# EAGLE schematic et312 (EAGLE 7.3.0)

## Sheet 1 of 6: Description Page
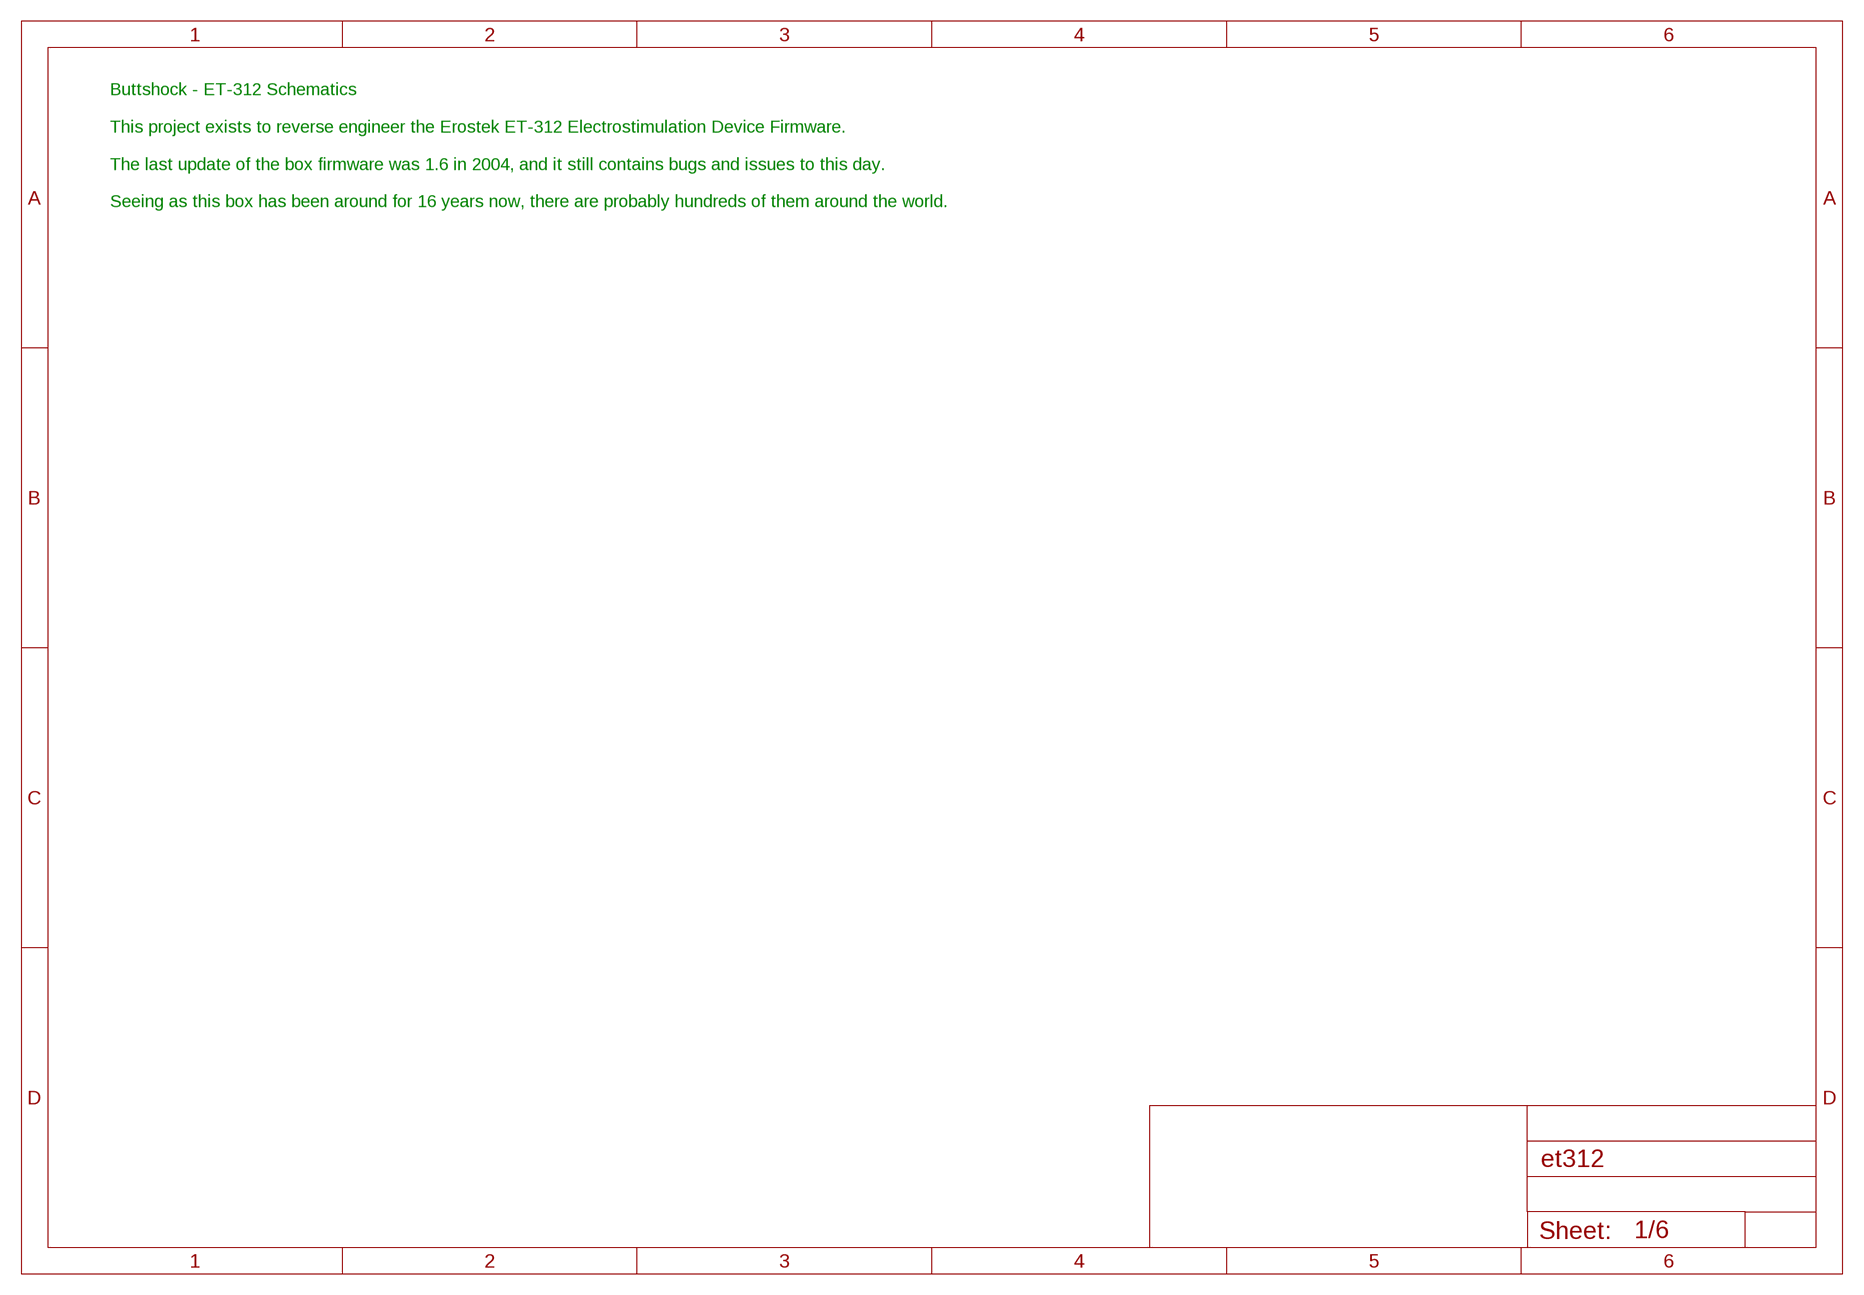
[diagram p0: schematic, sheet 1]

### Notes on the sheet
- Buttshock - ET-312 Schematics
  
  This project exists to reverse engineer the Erostek ET-312 Electrostimulation Device Firmware.
  
  The last update of the box firmware was 1.6 in 2004, and it still contains bugs and issues to this day.
  
  Seeing as this box has been around for 16 years now, there are probably hundreds of them around the world.

## Sheet 2 of 6: PSU
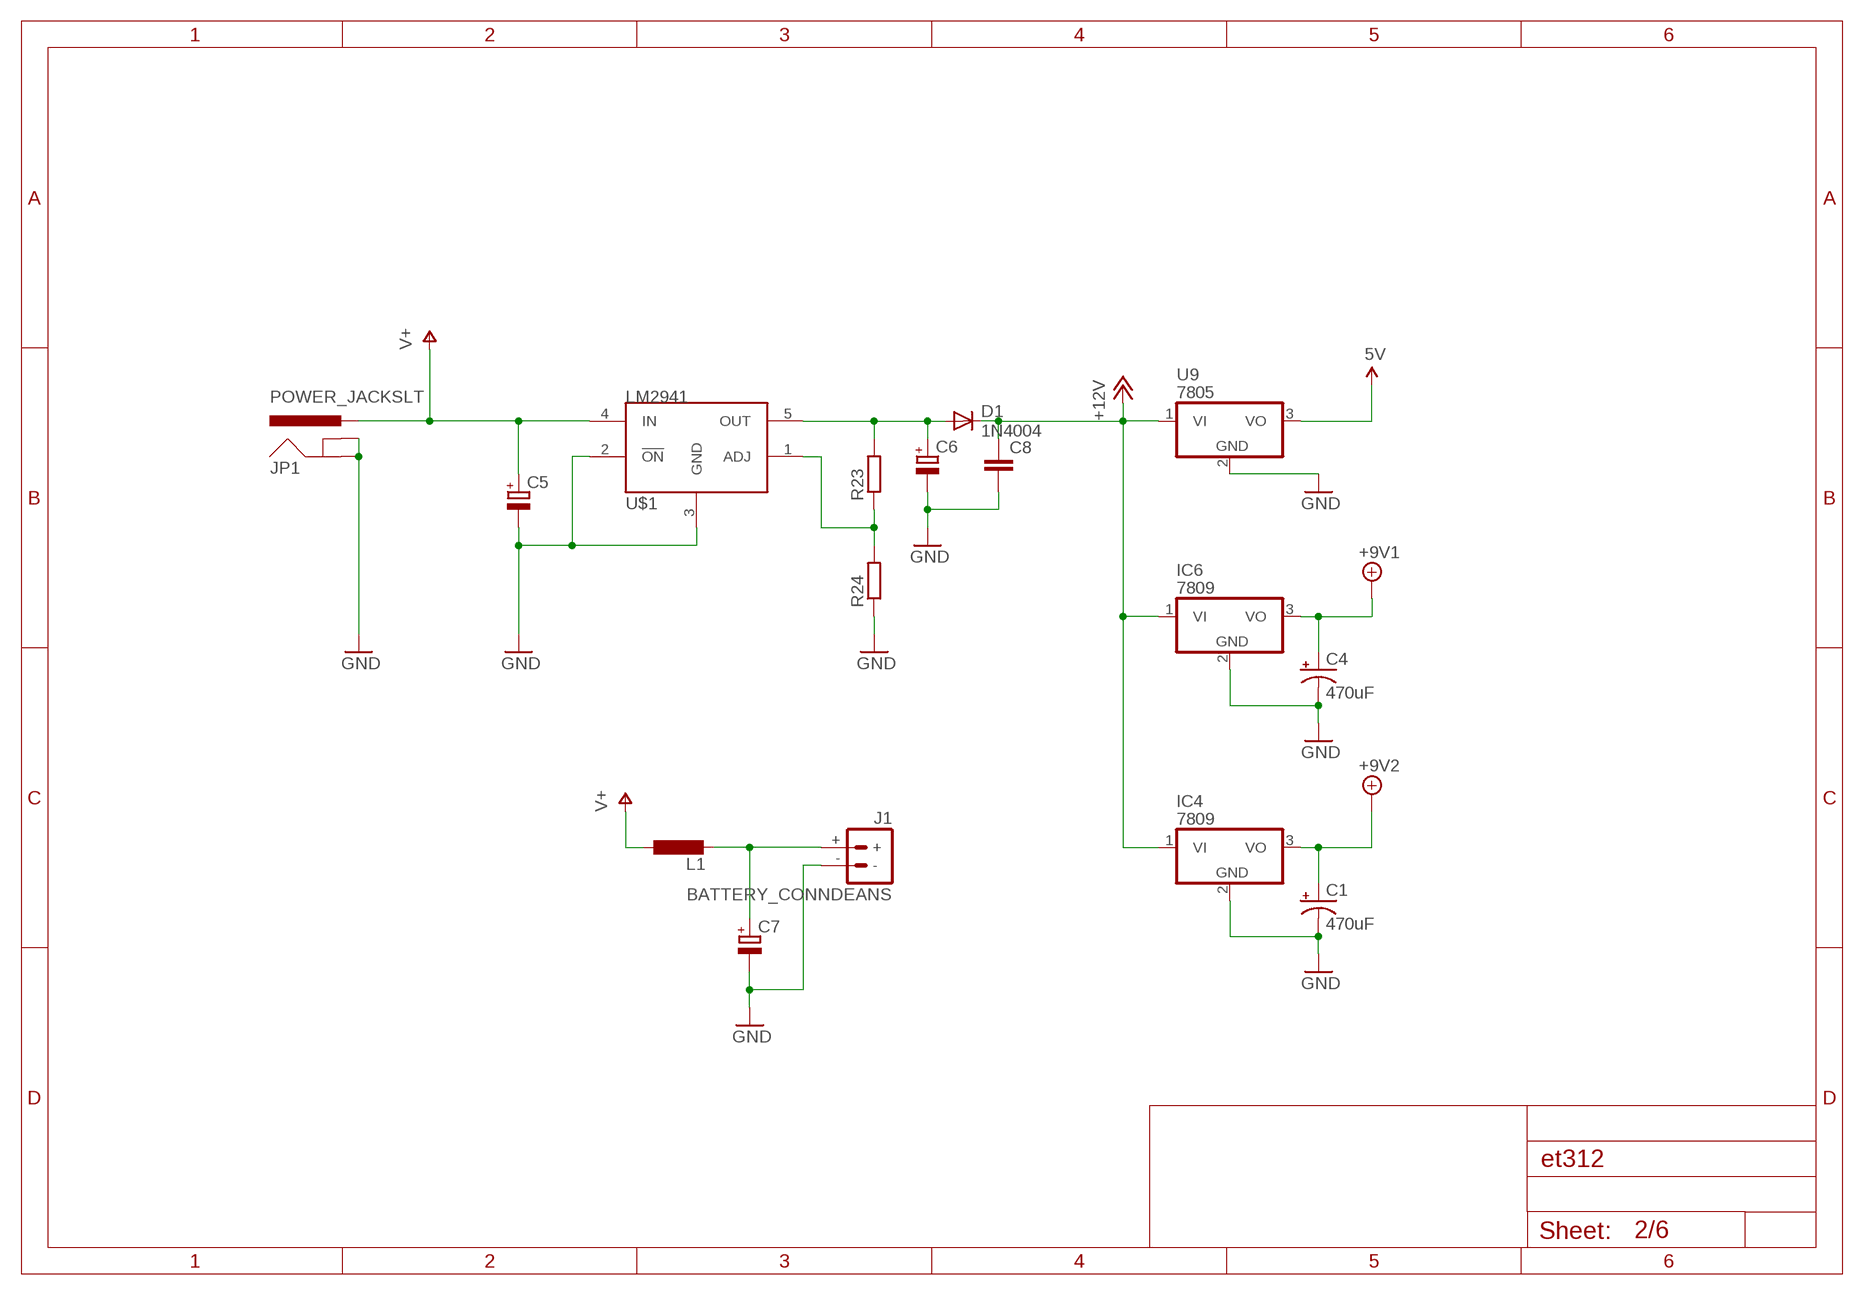
[diagram p1: schematic, sheet 2]

### Parts
C1  470uF  CAP_POLPTH1  [CPOL-RADIAL-100UF-25V]
C4  470uF  CAP_POLPTH1  [CPOL-RADIAL-100UF-25V]
C5  CPOL-EUE2.5-6  [E2,5-6]
C6  CPOL-EUE3.5-10  [E3,5-10]
C7  CPOL-EUE3.5-10  [E3,5-10]
C8  C-EU050-025X075  [C050-025X075]
D1  1N4004  [DO41-10]
IC4  7809  7805T  [TO220H]
IC6  7809  7805T  [TO220H]
J1  BATTERY_CONNDEANS  [DEANS]
JP1  POWER_JACKSLT  [POWER_JACK_SLOT]
L1  L-EU0207/10  [0207/10]
R23  R-EU_0204/7  [0204/7]
R24  R-EU_0204/7  [0204/7]
U9  7805  7805T  [TO220H]
U$1  LM2941  [T05A]

### Nets
5V: U9.3(VO) ; also sheet 3
+9V1: C4.1(+) IC6.3(VO) ; also sheet 6
+9V2: C1.1(+) IC4.3(VO) ; also sheet 6
+12V: C8.1 D1.C IC4.1(VI) IC6.1(VI) U9.1(VI) ; also sheet 3
GND: C1.2(-) C4.2(-) C5.- C6.- C7.- C8.2 IC4.2(GND) IC6.2(GND) J1.- JP1.GND@1(GNDBREAK) JP1.GND@2(GND) R24.1 U9.2(GND) U$1.2(!ON) U$1.3(GND) ; also sheet 3,5,6
N$31: C7.+ J1.+ L1.2
N$43: R23.1 R24.2 U$1.1(ADJ)
N$45: C6.+ D1.A R23.2 U$1.5(OUT)
V+: C5.+ JP1.PWR L1.1 U$1.4(IN) ; also sheet 3

## Sheet 3 of 6
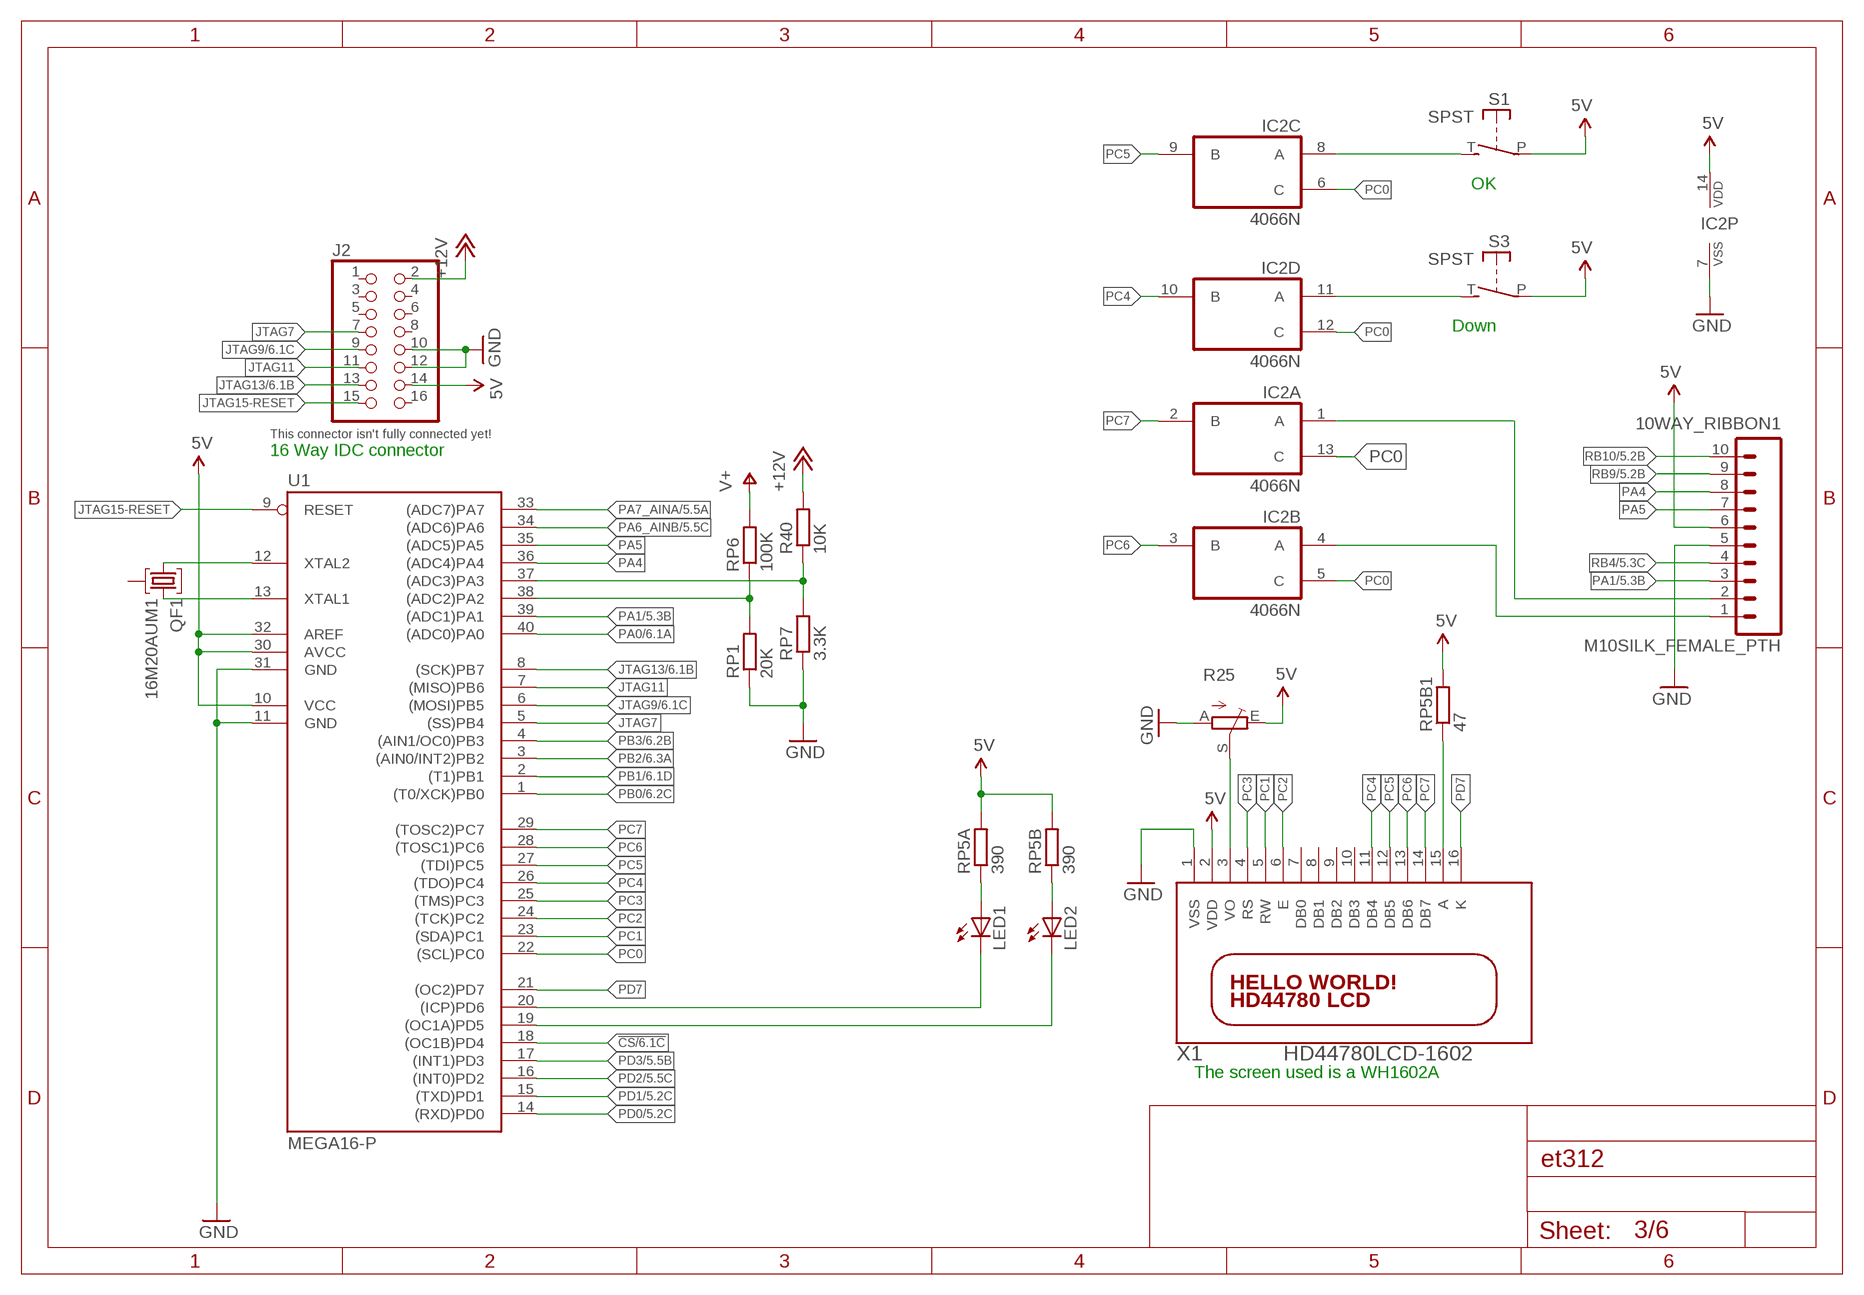
[diagram p2: schematic, sheet 3]

### Parts
10WAY_RIBBON1  M10SILK_FEMALE_PTH  [1X10]
IC2  4066N  [DIL14]
J2  PINHD-2X8  [2X08]
LED1  LED3MM  [LED3MM]
LED2  LED3MM  [LED3MM]
QF1  16M20AUM1  [UM1]
R25  TRIM_EU-LI10  [LI10]
R40  10K  R-EU_0207/7  [0207/7]
RP1  20K  R-EU_0207/7  [0207/7]
RP5A  390  R-EU_0207/7  [0207/7]
RP5B  390  R-EU_0207/7  [0207/7]
RP5B1  47  R-EU_0207/7  [0207/7]
RP6  100K  R-EU_0207/7  [0207/7]
RP7  3.3K  R-EU_0207/7  [0207/7]
S1  SPST  [JUDCOSPST]
S3  SPST  [JUDCOSPST]
U1  MEGA16-P  [DIL40]
X1  HD44780LCD-1602  [LCD1602]

### Nets
5V: 10WAY_RIBBON1.6 IC2.14(P:VDD) J2.14 R25.E RP5A.2 RP5B1.2 RP5B.2 S1.P S3.P U1.10(VCC) U1.30(AVCC) U1.32(AREF) X1.2(VDD) ; also sheet 2
!CS: U1.18((OC1B)PD4) ; also sheet 6
+12V: J2.2 R40.2 ; also sheet 2
GND: 10WAY_RIBBON1.5 IC2.7(P:VSS) J2.10 J2.12 R25.A RP1.1 RP7.1 U1.11(GND) U1.31(GND) X1.1(VSS) ; also sheet 2,5,6
JTAG7: J2.7 U1.5((SS)PB4)
JTAG9: J2.9 U1.6((MOSI)PB5) ; also sheet 6
JTAG11: J2.11 U1.7((MISO)PB6)
JTAG13: J2.13 U1.8((SCK)PB7) ; also sheet 6
JTAG15-RESET: J2.15 U1.9(RESET)
N$4: IC2.8(C:A) S1.T(S)
N$5: IC2.11(D:A) S3.T(S)
N$7: 10WAY_RIBBON1.1 IC2.4(B:A)
N$8: 10WAY_RIBBON1.2 IC2.1(A:A)
N$17: QF1.3 U1.13(XTAL1)
N$23: LED2.A RP5B.1
N$29: LED1.A RP5A.1
N$30: R25.S X1.3(VO)
N$32: QF1.1 U1.12(XTAL2)
N$47: RP5B1.1 X1.15(A)
PA0: U1.40((ADC0)PA0) ; also sheet 6
PA1: 10WAY_RIBBON1.3 U1.39((ADC1)PA1) ; also sheet 5
PA4: 10WAY_RIBBON1.8 R40.1 RP7.2 U1.36((ADC4)PA4) U1.37((ADC3)PA3)
PA5: 10WAY_RIBBON1.7 RP1.2 RP6.1 U1.35((ADC5)PA5) U1.38((ADC2)PA2)
PA6_AINB: U1.34((ADC6)PA6) ; also sheet 5
PA7_AINA: U1.33((ADC7)PA7) ; also sheet 5
PB0: U1.1((T0/XCK)PB0) ; also sheet 6
PB1: U1.2((T1)PB1) ; also sheet 6
PB2: U1.3((AIN0/INT2)PB2) ; also sheet 6
PB3: U1.4((AIN1/OC0)PB3) ; also sheet 6
PC0: IC2.5(B:C) IC2.6(C:C) IC2.12(D:C) IC2.13(A:C) U1.22((SCL)PC0)
PC1: U1.23((SDA)PC1) X1.5(RW)
PC2: U1.24((TCK)PC2) X1.6(E)
PC3: U1.25((TMS)PC3) X1.4(RS)
PC4: IC2.10(D:B) U1.26((TDO)PC4) X1.11(DB4)
PC5: IC2.9(C:B) U1.27((TDI)PC5) X1.12(DB5)
PC6: IC2.3(B:B) U1.28((TOSC1)PC6) X1.13(DB6)
PC7: IC2.2(A:B) U1.29((TOSC2)PC7) X1.14(DB7)
PD0: U1.14((RXD)PD0) ; also sheet 5
PD1: U1.15((TXD)PD1) ; also sheet 5
PD2: U1.16((INT0)PD2) ; also sheet 5
PD3: U1.17((INT1)PD3) ; also sheet 5
PD5: LED2.K(C) U1.19((OC1A)PD5)
PD6: LED1.K(C) U1.20((ICP)PD6)
PD7: U1.21((OC2)PD7) X1.16(K)
RB4: 10WAY_RIBBON1.4 ; also sheet 5
RB9: 10WAY_RIBBON1.9 ; also sheet 5
RB10: 10WAY_RIBBON1.10 ; also sheet 5
V+: RP6.2 ; also sheet 2
Unconnected: J2.1 J2.3 J2.4 J2.5 J2.6 J2.8 J2.16 QF1.2 X1.7(DB0) X1.8(DB1) X1.9(DB2) X1.10(DB3)

### Notes on the sheet
- OK
- Down
- This connector isn't fully connected yet!
- 16 Way IDC connector
- The screen used is a WH1602A

## Sheet 4 of 6: Small PCB
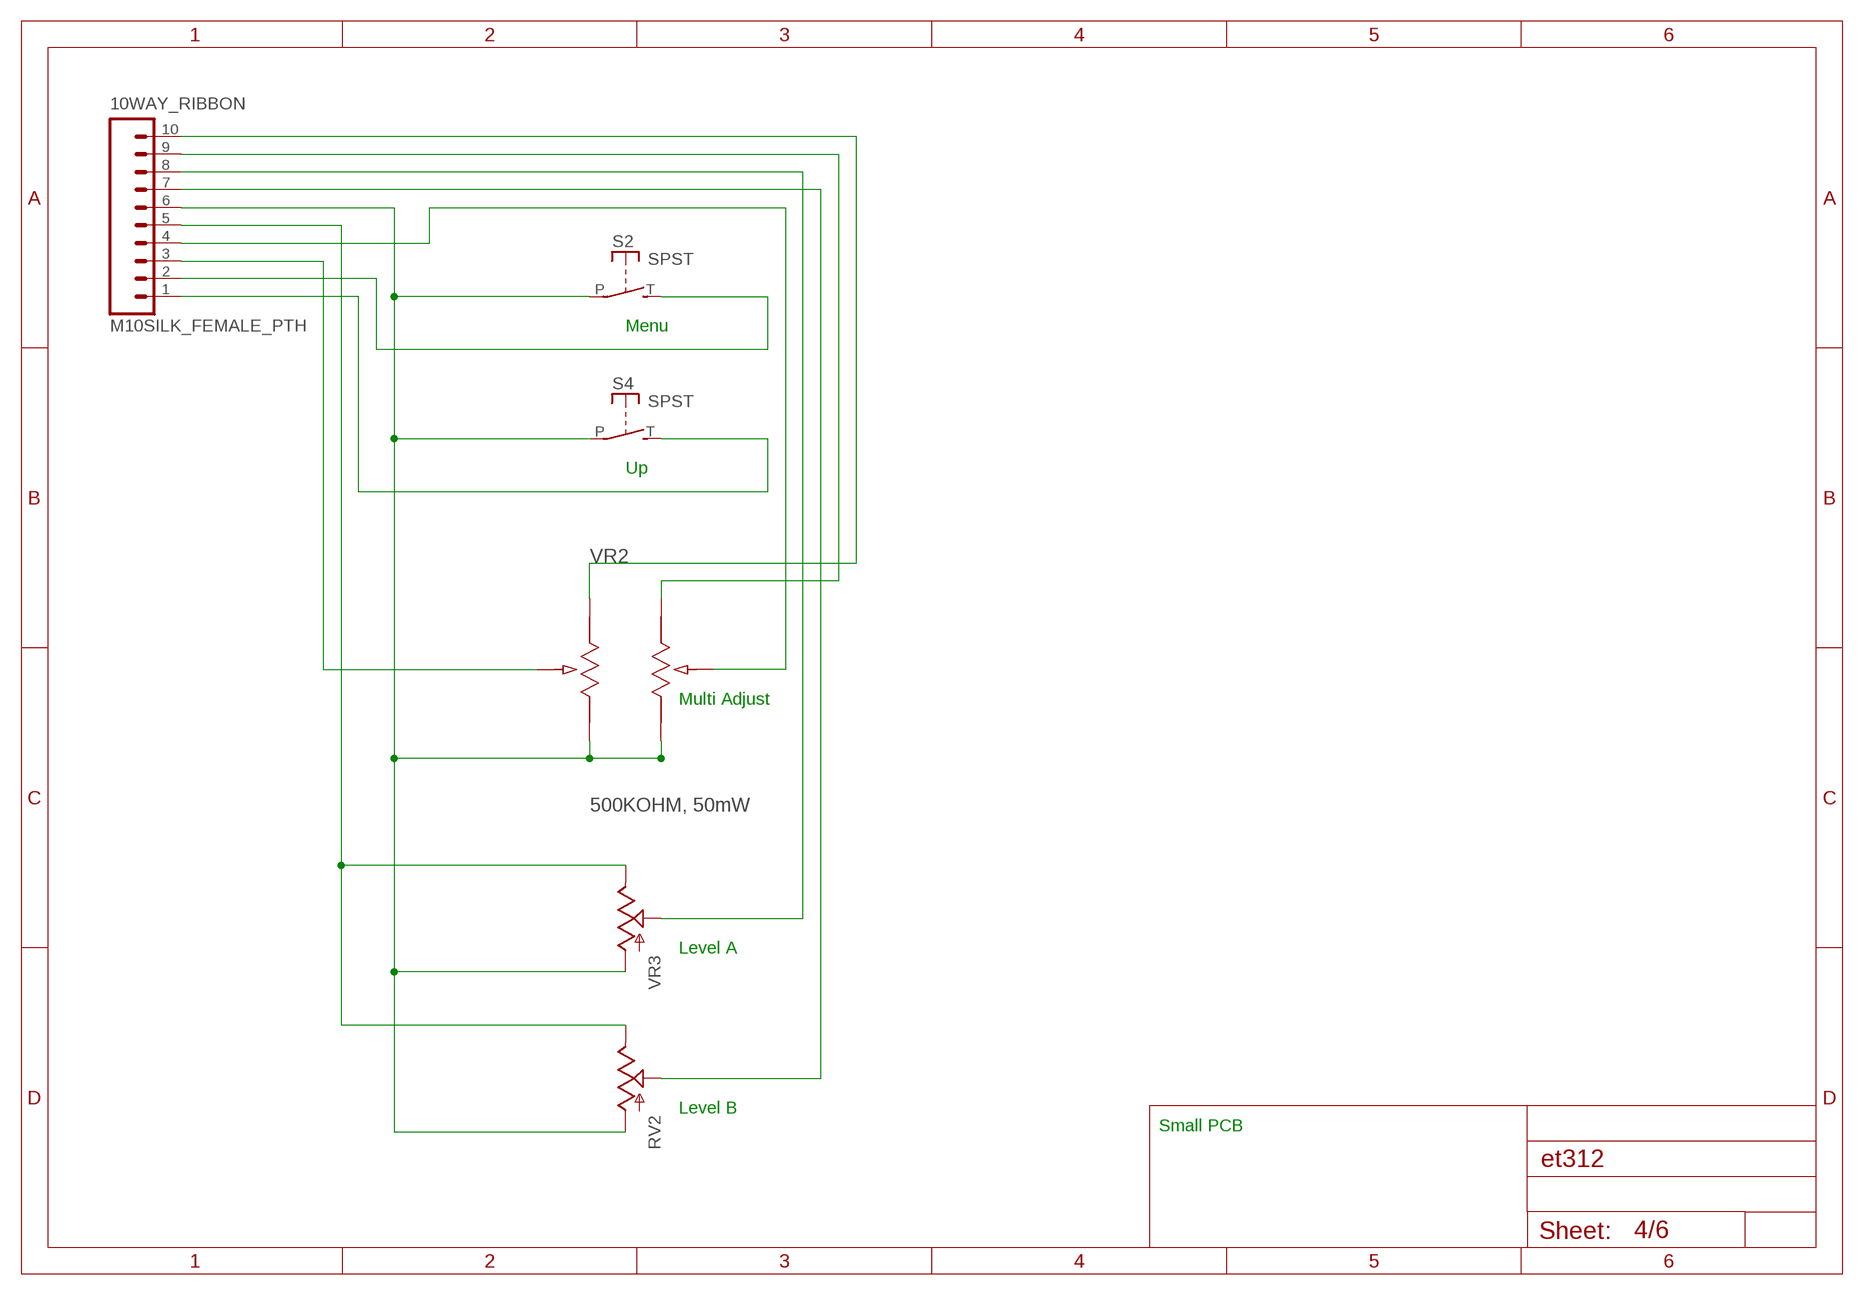
[diagram p3: schematic, sheet 4]

### Parts
10WAY_RIBBON  M10SILK_FEMALE_PTH  [1X10]
RV2  POT  [ALPS_POT]
S2  SPST  [JUDCOSPST]
S4  SPST  [JUDCOSPST]
VR2  500KOHM, 50mW  EVJC20F02A14-JC2  [POT_EVJC20]
VR3  POT  [ALPS_POT]

### Nets
N$1: 10WAY_RIBBON.6 RV2.P$3(A) S2.P S4.P VR2.1 VR2.1' VR3.P$3(A)
N$2: 10WAY_RIBBON.2 S2.T(S)
N$3: 10WAY_RIBBON.1 S4.T(S)
N$10: 10WAY_RIBBON.9 VR2.3'
N$11: 10WAY_RIBBON.8 VR3.P$2(S)
N$12: 10WAY_RIBBON.7 RV2.P$2(S)
N$13: 10WAY_RIBBON.10 VR2.3
N$14: 10WAY_RIBBON.4 VR2.2'
N$15: 10WAY_RIBBON.3 VR2.2
VR4: 10WAY_RIBBON.5 RV2.P$1(E) VR3.P$1(E)

### Notes on the sheet
- Menu
- Up
- Multi Adjust
- Level A
- Level B
- Small PCB

## Sheet 5 of 6: Input stage
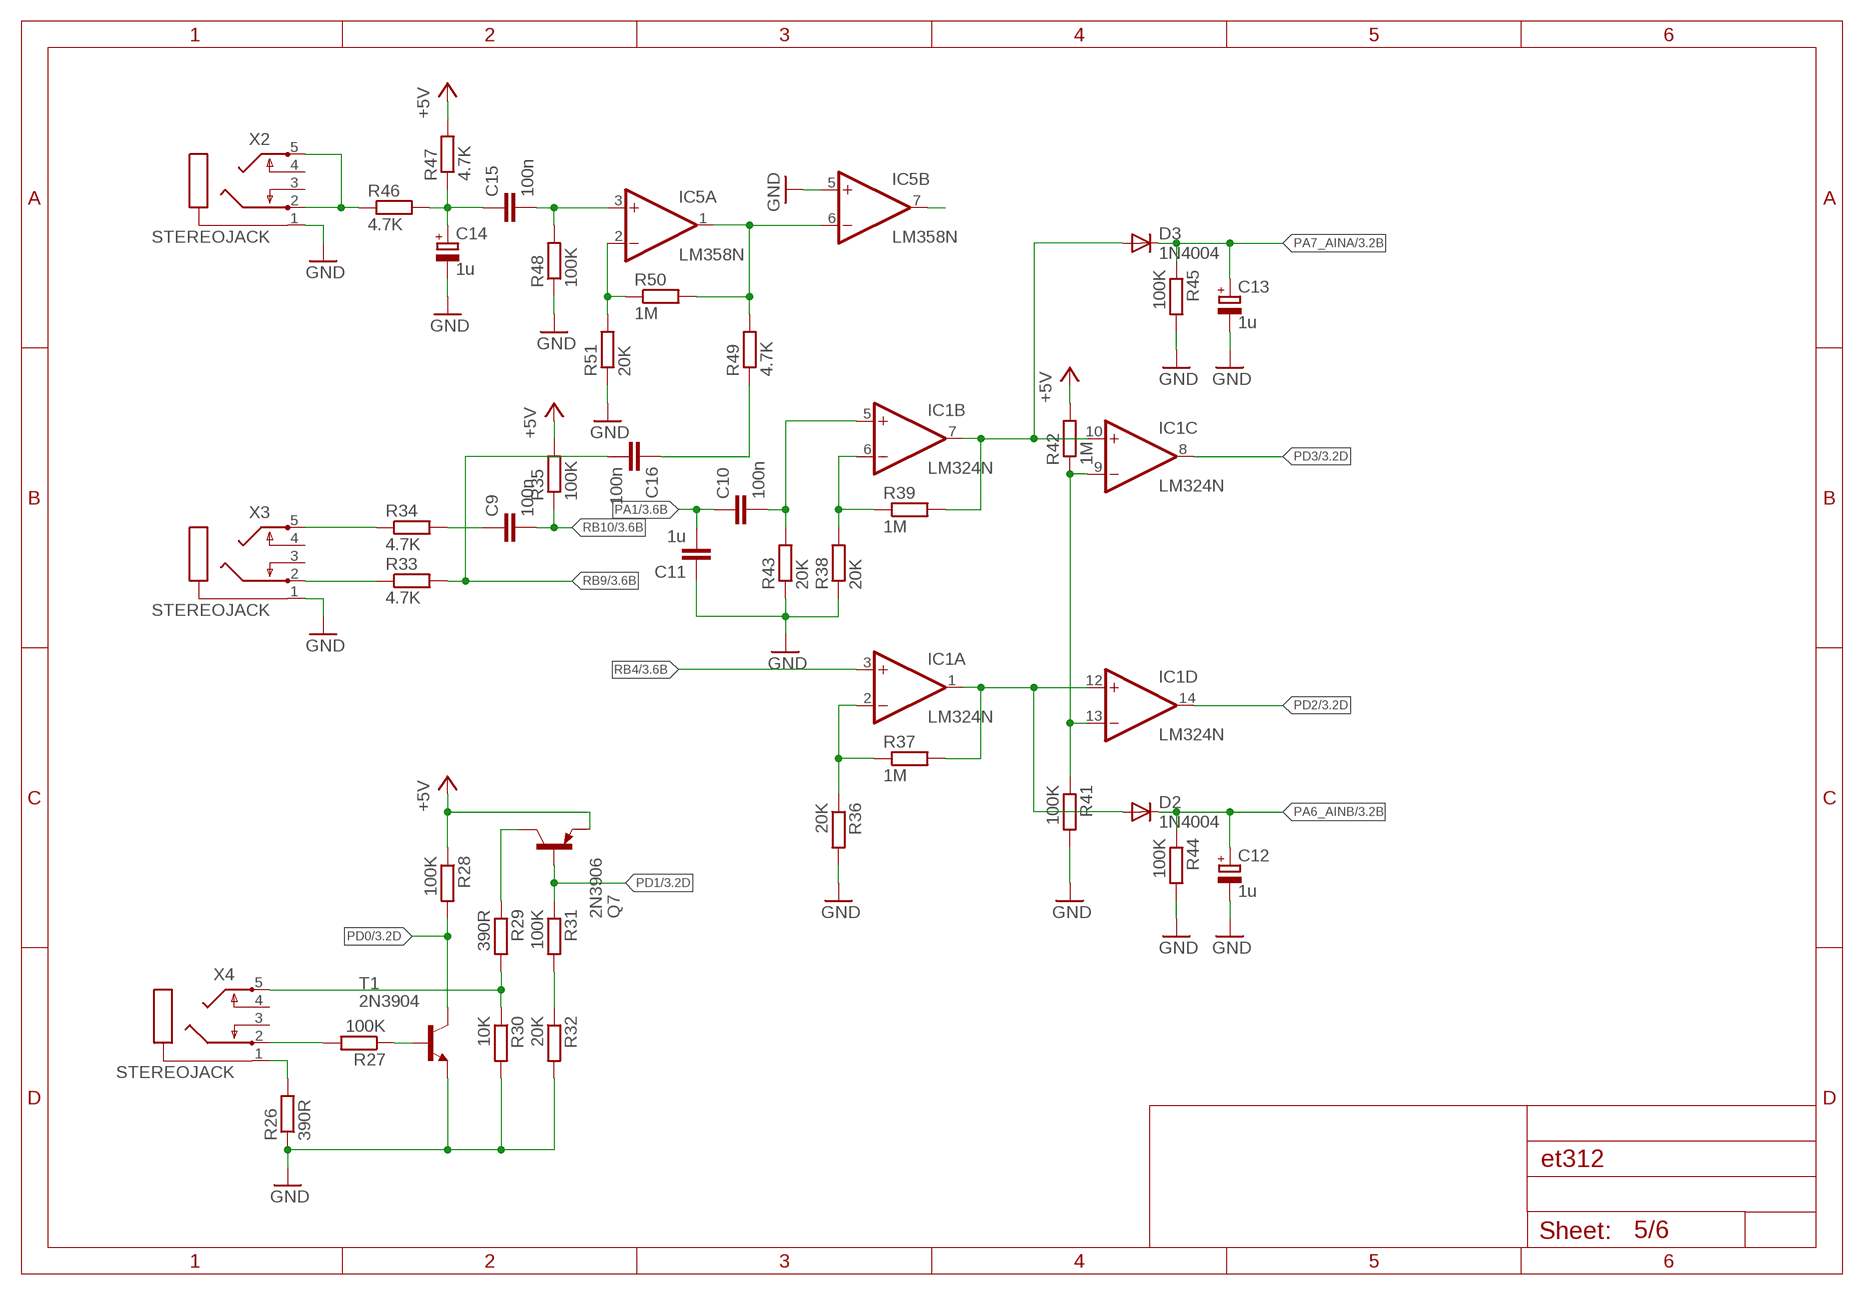
[diagram p4: schematic, sheet 5]

### Parts
C9  100n  C-EU050-025X075  [C050-025X075]
C10  100n  C-EU050-025X075  [C050-025X075]
C11  1u  C-EU050-025X075  [C050-025X075]
C12  1u  CPOL-EUE2.5-5  [E2,5-5]
C13  1u  CPOL-EUE2.5-5  [E2,5-5]
C14  1u  CPOL-EUE2.5-5  [E2,5-5]
C15  100n  C-EU050-025X075  [C050-025X075]
C16  100n  C-EU050-025X075  [C050-025X075]
D2  1N4004  [DO41-10]
D3  1N4004  [DO41-10]
IC1  LM324N  [DIL14]
IC5  LM358N  [DIL08]
Q7  2N3906  [TO92]
R26  390R  R-EU_0207/10  [0207/10]
R27  100K  R-EU_0207/10  [0207/10]
R28  100K  R-EU_0207/10  [0207/10]
R29  390R  R-EU_0207/10  [0207/10]
R30  10K  R-EU_0207/10  [0207/10]
R31  100K  R-EU_0207/10  [0207/10]
R32  20K  R-EU_0207/10  [0207/10]
R33  4.7K  R-EU_0207/10  [0207/10]
R34  4.7K  R-EU_0207/10  [0207/10]
R35  100K  R-EU_0207/10  [0207/10]
R36  20K  R-EU_0207/10  [0207/10]
R37  1M  R-EU_0207/10  [0207/10]
R38  20K  R-EU_0207/10  [0207/10]
R39  1M  R-EU_0207/10  [0207/10]
R41  100K  R-EU_0207/10  [0207/10]
R42  1M  R-EU_0207/10  [0207/10]
R43  20K  R-EU_0207/10  [0207/10]
R44  100K  R-EU_0207/10  [0207/10]
R45  100K  R-EU_0207/10  [0207/10]
R46  4.7K  R-EU_0207/10  [0207/10]
R47  4.7K  R-EU_0207/10  [0207/10]
R48  100K  R-EU_0207/10  [0207/10]
R49  4.7K  R-EU_0207/10  [0207/10]
R50  1M  R-EU_0207/10  [0207/10]
R51  20K  R-EU_0207/10  [0207/10]
T1  2N3904  [TO92]
X2  STEREOJACK  [STX3100]
X3  STEREOJACK  [STX3100]
X4  STEREOJACK  [STX3100]

### Nets
+5V: Q7.3(E) R28.1 R35.2 R42.2 R47.2
GND: C11.1 C12.- C13.- C14.- IC5.5(B:+IN) R26.1 R30.2 R32.2 R36.2 R38.1 R41.2 R43.1 R44.2 R45.2 R48.1 R51.1 T1.3(E) X2.1 X3.1 ; also sheet 2,3,6
N$9: R26.2 X4.1
N$44: R29.2 R30.1 X4.5
N$46: R27.2 X4.2
N$48: R27.1 T1.2(B)
N$51: R31.2 R32.1
N$52: Q7.1(C) R29.1
N$53: IC1.2(A:-IN) R36.1 R37.1
N$54: D2.A IC1.1(A:OUT) IC1.12(D:+IN) R37.2
N$55: R33.1 X3.2
N$56: R34.1 X3.5
N$57: C9.1 R34.2
N$60: IC1.6(B:-IN) R38.2 R39.1
N$61: IC5.7(B:OUT)
N$62: IC1.9(C:-IN) IC1.13(D:-IN) R41.1 R42.1
N$63: C10.2 IC1.5(B:+IN) R43.2
N$69: D3.A IC1.7(B:OUT) IC1.10(C:+IN) R39.2
N$71: R46.1 X2.2 X2.5
N$72: C14.+ C15.1 R46.2 R47.1
N$73: C15.2 IC5.3(A:+IN) R48.2
N$74: IC5.2(A:-IN) R50.1 R51.2
N$75: IC5.1(A:OUT) IC5.6(B:-IN) R49.2 R50.2
N$76: C16.1 R49.1
PA1: C10.1 C11.2 ; also sheet 3
PA6_AINB: C12.+ D2.C R44.1 ; also sheet 3
PA7_AINA: C13.+ D3.C R45.1 ; also sheet 3
PD0: R28.2 T1.1(C) ; also sheet 3
PD1: Q7.2(B) R31.1 ; also sheet 3
PD2: IC1.14(D:OUT) ; also sheet 3
PD3: IC1.8(C:OUT) ; also sheet 3
RB4: IC1.3(A:+IN) ; also sheet 3
RB9: C16.2 R33.2 ; also sheet 3
RB10: C9.2 R35.1 ; also sheet 3
Unconnected: X2.3 X2.4 X3.3 X3.4 X4.3 X4.4

## Sheet 6 of 6: Output stage
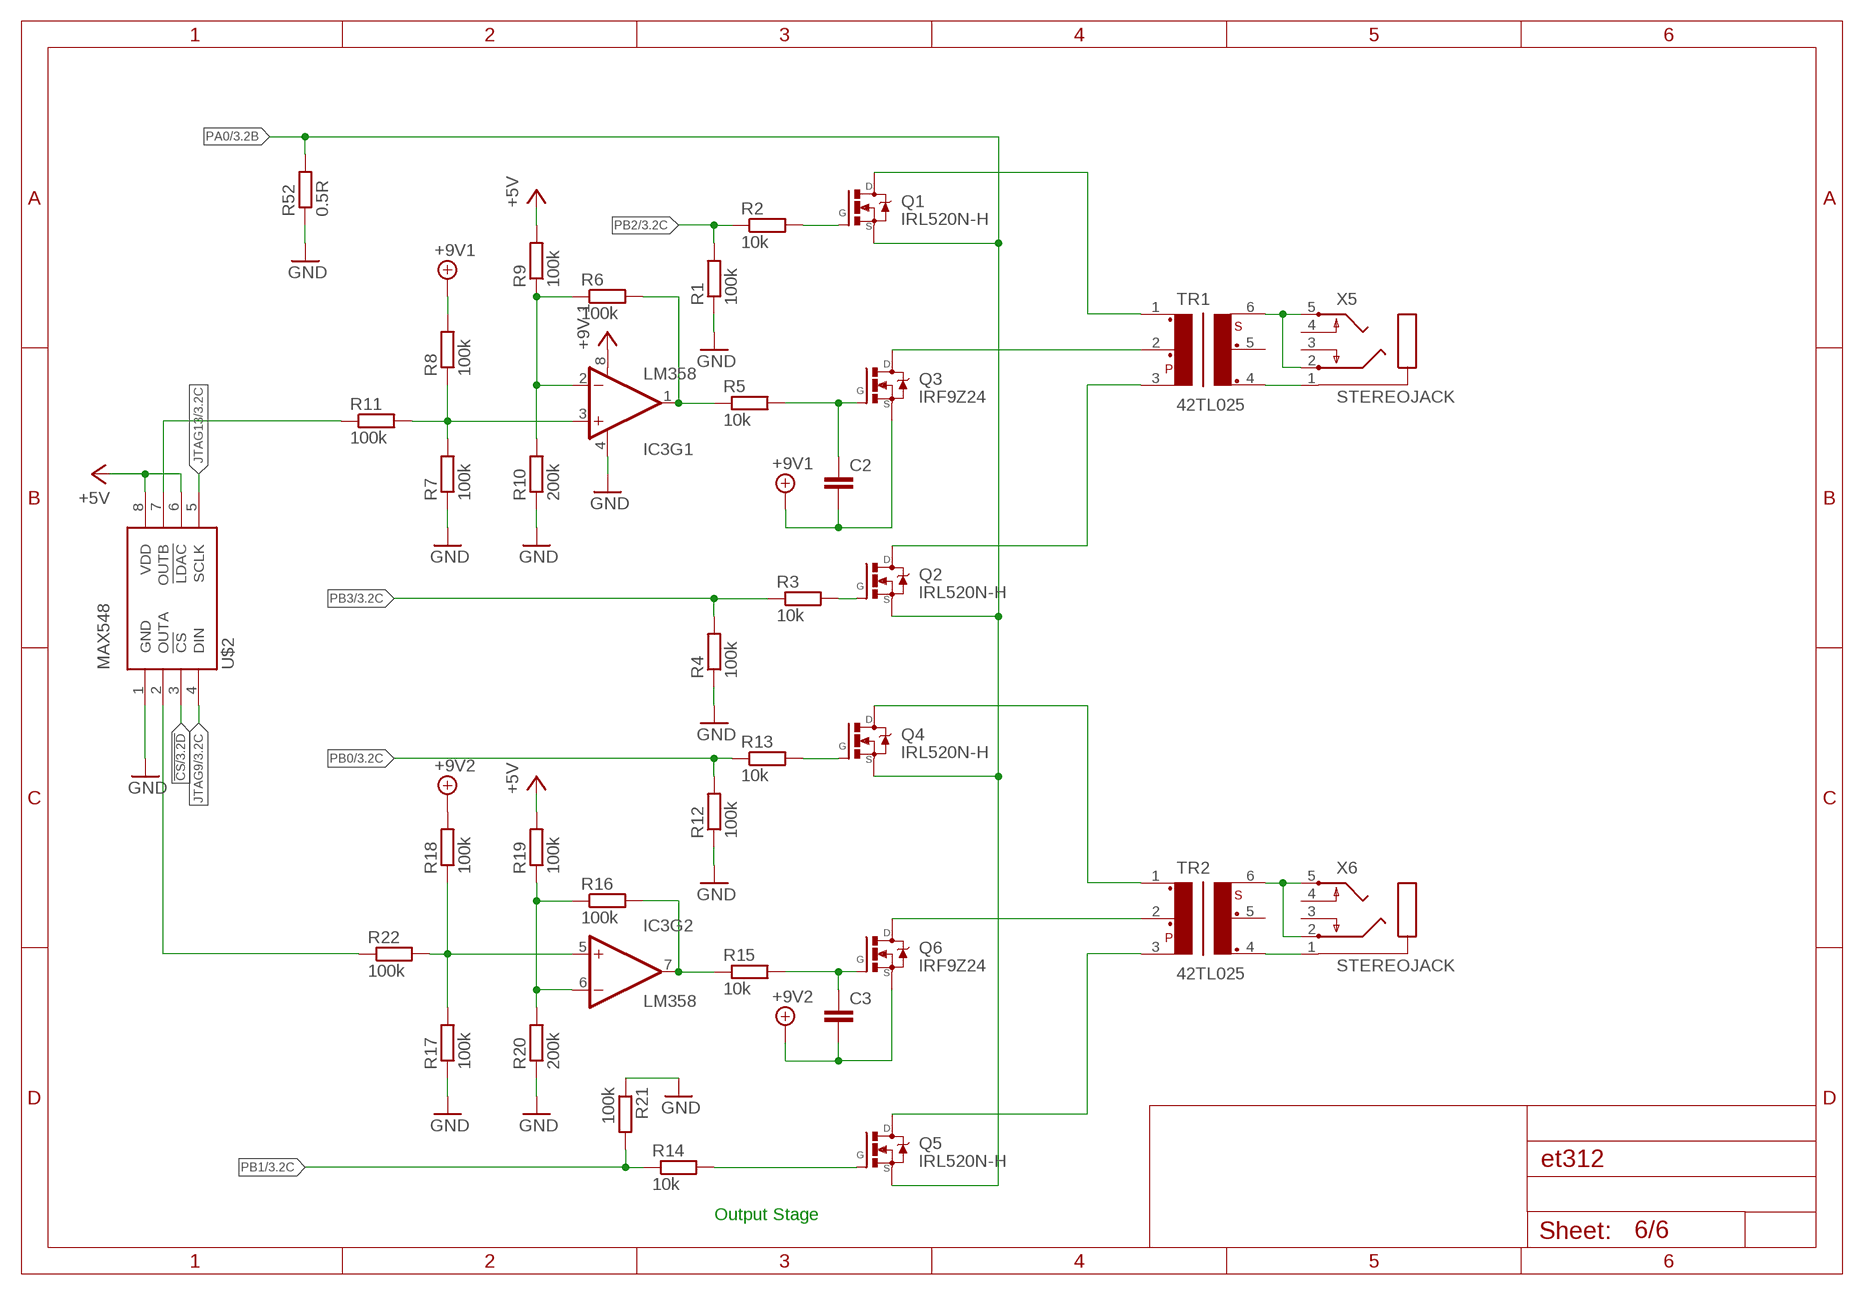
[diagram p5: schematic, sheet 6]

### Parts
C2  CAPPTH  [CAP-PTH-SMALL]
C3  CAPPTH  [CAP-PTH-SMALL]
IC3  LM358  [DIP08]
Q1  IRL520N-H  IRL530N-H  [TO220]
Q2  IRL520N-H  IRL530N-H  [TO220]
Q3  IRF9Z24  IRL530N-H  [TO220]
Q4  IRL520N-H  IRL530N-H  [TO220]
Q5  IRL520N-H  IRL530N-H  [TO220]
Q6  IRF9Z24  IRL530N-H  [TO220]
R1  100k  R0207/10  [0207/10]
R2  10k  R0207/10  [0207/10]
R3  10k  R0207/10  [0207/10]
R4  100k  R0207/10  [0207/10]
R5  10k  R0207/10  [0207/10]
R6  100k  R0207/10  [0207/10]
R7  100k  R0207/10  [0207/10]
R8  100k  R0207/10  [0207/10]
R9  100k  R0207/10  [0207/10]
R10  200k  R0207/10  [0207/10]
R11  100k  R0207/10  [0207/10]
R12  100k  R0207/10  [0207/10]
R13  10k  R0207/10  [0207/10]
R14  10k  R0207/10  [0207/10]
R15  10k  R0207/10  [0207/10]
R16  100k  R0207/10  [0207/10]
R17  100k  R0207/10  [0207/10]
R18  100k  R0207/10  [0207/10]
R19  100k  R0207/10  [0207/10]
R20  200k  R0207/10  [0207/10]
R21  100k  R0207/10  [0207/10]
R22  100k  R0207/10  [0207/10]
R52  0.5R  R0207/10  [0207/10]
TR1  42TL025  [42TL]
TR2  42TL025  [42TL]
U$2  MAX548  [DIL08]
X5  STEREOJACK  [STX3100]
X6  STEREOJACK  [STX3100]

### Nets
!CS: U$2.3(!CS) ; also sheet 3
+9V1: C2.2 Q3.3(S) R8.2 ; also sheet 2
+9V2: C3.2 Q6.3(S) R18.2 ; also sheet 2
GND: IC3.4(V-) R1.1 R4.1 R7.1 R10.1 R12.1 R17.1 R20.1 R21.1 R52.1 U$2.1(GND) ; also sheet 2,3,5
JTAG9: U$2.4(DIN) ; also sheet 3
JTAG13: U$2.5(SCLK) ; also sheet 3
N$6: TR1.4 X5.1
N$16: TR1.6 X5.2 X5.5
N$18: Q1.1(G) R2.2
N$19: Q2.1(G) R3.2
N$20: IC3.1(OUT) R5.1 R6.2
N$21: C2.1 Q3.1(G) R5.2
N$22: IC3.3(+IN) R7.2 R8.1 R11.2
N$24: Q4.1(G) R13.2
N$25: Q5.1(G) R14.2
N$26: IC3.7(OUT) R15.1 R16.2
N$27: C3.1 Q6.1(G) R15.2
N$28: IC3.5(+IN) R17.2 R18.1 R22.2
N$33: R22.1 U$2.2(OUTA)
N$34: Q1.2(D) TR1.1
N$35: Q3.2(D) TR1.2
N$36: Q4.2(D) TR2.1
N$37: Q6.2(D) TR2.2
N$38: Q5.2(D) TR2.3
N$39: Q2.2(D) TR1.3
N$40: IC3.2(-IN) R6.1 R9.1 R10.2
N$41: IC3.6(-IN) R16.1 R19.1 R20.2
N$42: R11.1 U$2.7(OUTB)
N$49: TR2.6 X6.2 X6.5
N$50: TR2.4 X6.1
PA0: Q1.3(S) Q2.3(S) Q4.3(S) Q5.3(S) R52.2 ; also sheet 3
PB0: R12.2 R13.1 ; also sheet 3
PB1: R14.1 R21.2 ; also sheet 3
PB2: R1.2 R2.1 ; also sheet 3
PB3: R3.1 R4.2 ; also sheet 3
VCC: IC3.8(V+) R9.2 R19.2 U$2.6(!LDAC) U$2.8(VDD) ; supply symbol labelled +5V, +9V 1
Unconnected: TR1.5 TR2.5 X5.3 X5.4 X6.3 X6.4

### Notes on the sheet
- Output Stage

## Power pins joined to a net without a drawn wire
V+: IC1.4(P:V+) IC5.8(P:V+)
V-: IC1.11(P:V-) IC5.4(P:V-)

## Library data of the parts
10WAY_RIBBON 10WAY_RIBBON1 = SparkFun-Connectors:M10: Header 10 Standard 10-pin 0.1" header. Use with straight break away headers (SKU : PRT-00116), right angle break away headers (PRT-00553), swiss pins (PRT-00743), machine pins (PRT-00117), and female headers (PRT-00115).; PROD_ID: CONN-11563
C1 C4 = SparkFun-Passives:CAP_POL: Capacitor Polarized These are standard SMD and PTH capacitors. Normally 10uF, 47uF, and 100uF in electrolytic and tantalum varieties. Always verify the external diameter of the through hole cap, it varies with capacity, voltage, and manufacturer. The EIA devices should be standard.
C2 C3 = SparkFun-Passives:CAP: Capacitor Standard 0603 ceramic capacitor, and 0.1" leaded capacitor.
C5-C7 C12-C14 = rcl:CPOL-EU: POLARIZED CAPACITOR, European symbol
C8-C11 C15 C16 = rcl:C-EU: CAPACITOR, European symbol
D1 = diode:1N4004: DIODE
D2 D3 = adafruit:1N4004: DIODE
IC1 = linear:LM324: OP AMP
IC2 = 40xx:4066: Quad bilateral ANALOG SWITCH
IC3 = SparkFun-AnalogIC:LM358: Jellybean op-amp; PROD_ID: IC-09172
IC4 IC6 U9 = adafruit:78*: Positive VOLTAGE REGULATOR Added bigger pads to the TO-92 package
IC5 = linear:LM358: OP AMP also LM158; LM258; LM2904 Source: http://cache.national.com/ds/LM/LM158.pdf
J1 = SparkFun-Connectors:BATTERY_CONN: Various footprints for battery connectors
J2 = pinhead:PINHD-2X8: PIN HEADER
JP1 = SparkFun-Connectors:POWER_JACK: Power Jack This is the standard 5.5mm barrel jack for power. The PTH is the most common, proven, reliable, footprint. The Slot footprint only works if the mill layer is transmitted to the PCB fab house so be warned. Mating wall wart : TOL-00298 (and others); PROD_ID: PRT-00119
L1 = rcl:L-EU: INDUCTOR, European symbol
LED1 LED2 = adafruit:LED: LED OSRAM: - CHIPLED LG R971, LG N971, LY N971, LG Q971, LY Q971, LO R971, LY R971 LH N974, LH R974 LS Q976, LO Q976, LY Q976 LO Q996 - Hyper CHIPLED LW Q18S LB Q993, LB Q99A, LB R99A - SideLED LS A670, LO A670, LY A670, LG A670, LP A670 LB A673, LV A673, LT A673, LW A673 LH A674 LY A675 LS A676, LA A676, LO A676, LY A676, LW A676 LS A679, LY A679, LG A679 - Hyper Micro SIDELED® LS Y876, LA Y876, LO Y876, LY Y876 LT Y87S - SmartLED LW L88C, LW L88S LB L89C, LB L89S, LG L890 LS L89K, LO L89K, LY L89K LS L896, LA L896, LO L896, LY L896 - TOPLED LS T670, LO T670, LY T670, LG T670, LP T670 LSG T670, LSP T670, LSY T670, LOP T670, LYG T670 LG T671, LOG T671, LSG T671 LB T673, LV T673, LT T673, LW T673 LH T674 LS T676, LA T676, LO T676, LY T676, LB T676, LH T676, LSB T676, LW T676 LB T67C, LV T67C, LT T67C, LS T67K, LO T67K, LY T67K, LW E67C LS E67B, LA E67B, LO E67B, LY E67B, LB E67C, LV E67C, LT E67C LW T67C LS T679, LY T679, LG T679 LS T770, LO T770, LY T770, LG T770, LP T770 LB T773, LV T773, LT T773, LW T773 LH T774 LS E675, LA E675, LY E675, LS T675 LS T776, LA T776, LO T776, LY T776, LB T776 LHGB T686 LT T68C, LB T68C - Hyper Mini TOPLED® LB M676 - Mini TOPLED Santana® LG M470 LS M47K, LO M47K, LY M47K Source: http://www.osram.convergy.de/
Q1-Q6 = transistor-fet-1:IRL530: MOSFET 17A 22.7nC 100mOhm Logic Level
Q7 = transistor-pnp:2N3906: PNP Transistor
QF1 = crystal:16M20AUM1: Monolithic Crystal Filters Source: www.vanlong.com; OC_FARNELL: unknown; OC_NEWARK: unknown
R1-R22 R52 = eagle-ltspice:R: RESISTOR, European symbol; SPICEMODEL: NONE; SPICEPREFIX: R
R23 R24 R26-R51 RP1 RP5A RP5B RP5B1 RP6 RP7 = rcl:R-EU_: RESISTOR, European symbol
R25 = pot:TRIM_EU-: POTENTIOMETER
RV2 VR3 = SparkFun-Electromechanical:POT
S1-S4 = adafruit:SPST: Judco 50-0015-00
T1 = transistor:2N3904: NPN TRANSISTOR
TR1 TR2 = trafo-xicon:42T?*: Xicon Micro-Mini EI-12 Audio Transformers 42TL/42TC/42TM Series Source: http://www.mouser.com//catalog/specsheets/164201.pdf http://www.mouser.com/catalog/specsheets/114225.pdf http://www.mouser.com/catalog/specsheets/164267.pdf; OC_FARNELL: unknown; OC_NEWARK: unknown
U1 = atmel:MEGA16-P: MICROCONTROLLER 16 Kbytes FLASH 1 kbytes SRAM 512 bytes EEPROM USART 8-channel 10 bit ADC Source: avr.lbr; MPN: ATMEGA16-16PU; OC_FARNELL: 9171142; OC_NEWARK: 01M6885
U$1 = JAEB:LM2941
U$2 = JAEB:MAX548
VR2 = Panasonic-Trimmer_Potentiometers:EVJ: 12 mm Square Two-in-One Rotary Potentiometers (Dual Type); MPN: EVJC20F02A14; OC_FARNELL: 2284569; OC_NEWARK: 52W2256; PACKAGE: TH-POT; SUPPLIER: PANASONIC
X1 = adafruit:HD44780LCD: HD44780 LCD Standard character type LCDs, available in sizes from 8x1 to 40x4!
X2-X6 = adafruit:STEREOJACK: MIC/HEADPHONE JACK Stereo jack with two switches. Kycon STX3100, CUI SJ1-3555NG and/or 4UCon 05544

## Net classes
0 default: width 0.4 mm
1 signal: width 0.254 mm
2 pwr: width 2 mm